# Altium project OSPLC2_2_STATUS.PrjPCB
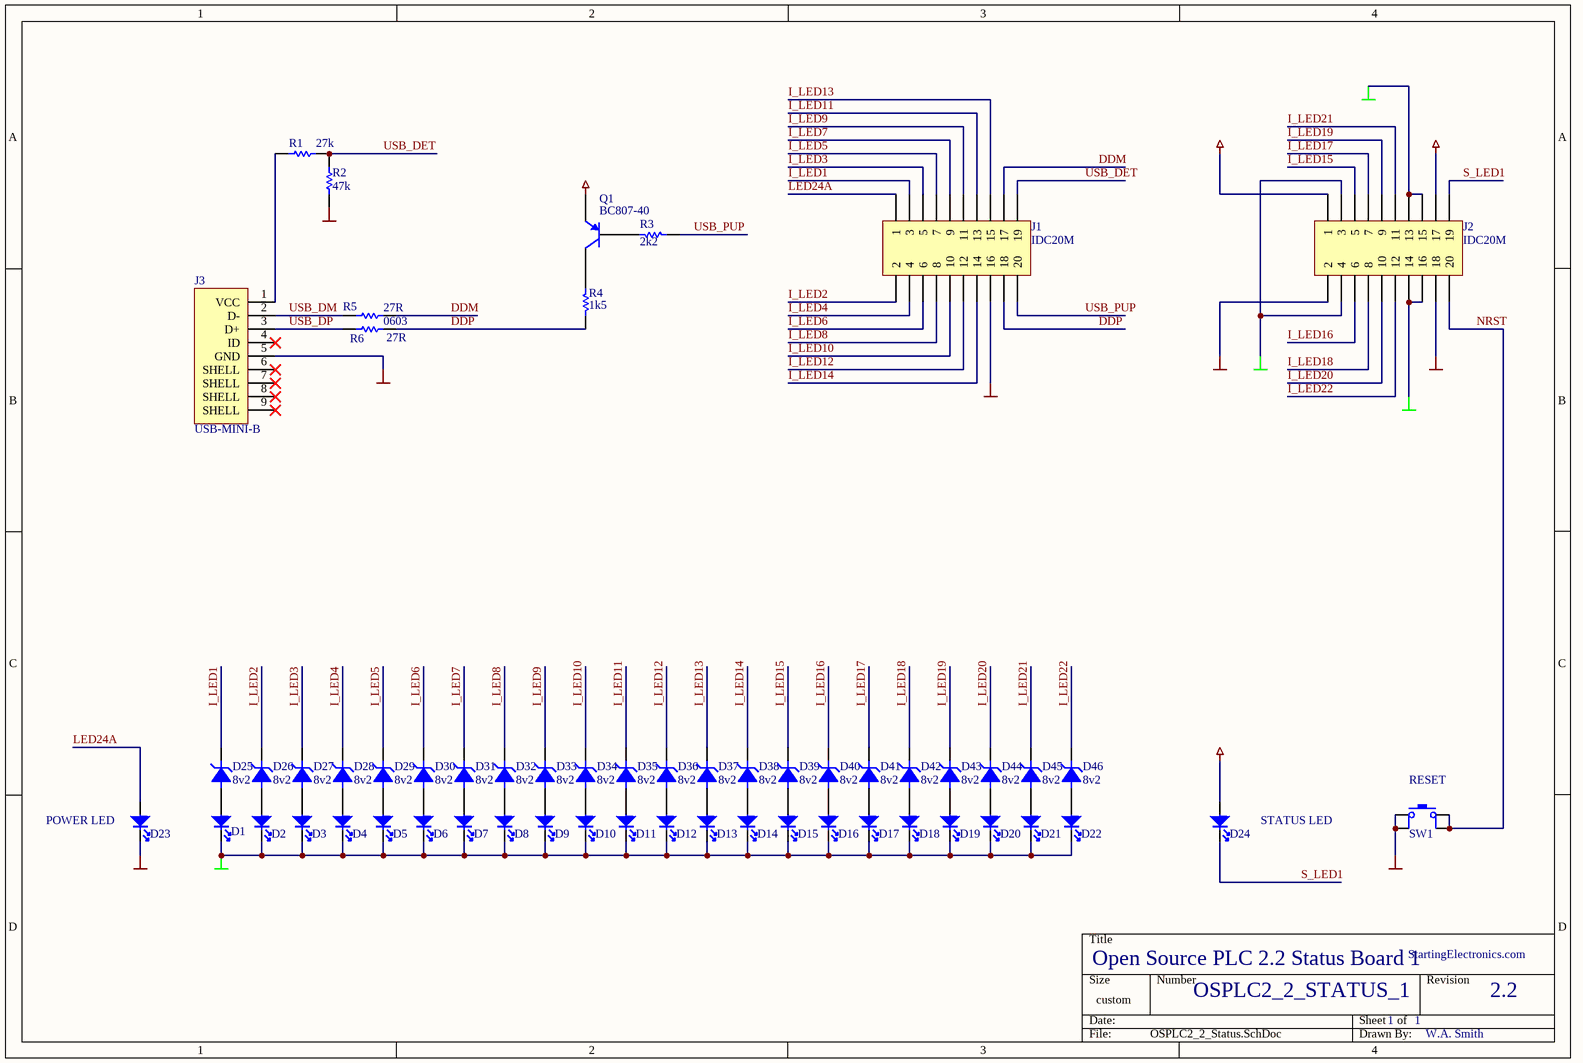
[diagram p0: OSPLC2_2_Status.SchDoc]
1 sheet, 57 parts. Net scope: global (net labels, ports and power ports of the same name join across sheets).
Board file: OSPLC2_2_STATUS.PcbDoc

## Sheet OSPLC2_2_Status.SchDoc
size 294 x 198 mm

### Parts
D1  LED  [1206_LED]  (value not drawn)
D2  LED  [1206_LED]  (value not drawn)
D3  LED  [1206_LED]  (value not drawn)
D4  LED  [1206_LED]  (value not drawn)
D5  LED  [1206_LED]  (value not drawn)
D6  LED  [1206_LED]  (value not drawn)
D7  LED  [1206_LED]  (value not drawn)
D8  LED  [1206_LED]  (value not drawn)
D9  LED  [1206_LED]  (value not drawn)
D10  LED  [1206_LED]  (value not drawn)
D11  LED  [1206_LED]  (value not drawn)
D12  LED  [1206_LED]  (value not drawn)
D13  LED  [1206_LED]  (value not drawn)
D14  LED  [1206_LED]  (value not drawn)
D15  LED  [1206_LED]  (value not drawn)
D16  LED  [1206_LED]  (value not drawn)
D17  LED  [1206_LED]  (value not drawn)
D18  LED  [1206_LED]  (value not drawn)
D19  LED  [1206_LED]  (value not drawn)
D20  LED  [1206_LED]  (value not drawn)
D21  LED  [1206_LED]  (value not drawn)
D22  LED  [1206_LED]  (value not drawn)
D23  LED  [1206_LED]  (value not drawn)
D24  LED  [1206_LED]  (value not drawn)
D25  8v2  [MELF-R2/X1.6]
D26  8v2  [MELF-R2/X1.6]
D27  8v2  [MELF-R2/X1.6]
D28  8v2  [MELF-R2/X1.6]
D29  8v2  [MELF-R2/X1.6]
D30  8v2  [MELF-R2/X1.6]
D31  8v2  [MELF-R2/X1.6]
D32  8v2  [MELF-R2/X1.6]
D33  8v2  [MELF-R2/X1.6]
D34  8v2  [MELF-R2/X1.6]
D35  8v2  [MELF-R2/X1.6]
D36  8v2  [MELF-R2/X1.6]
D37  8v2  [MELF-R2/X1.6]
D38  8v2  [MELF-R2/X1.6]
D39  8v2  [MELF-R2/X1.6]
D40  8v2  [MELF-R2/X1.6]
D41  8v2  [MELF-R2/X1.6]
D42  8v2  [MELF-R2/X1.6]
D43  8v2  [MELF-R2/X1.6]
D44  8v2  [MELF-R2/X1.6]
D45  8v2  [MELF-R2/X1.6]
D46  8v2  [MELF-R2/X1.6]
J1  IDC20M  [IDC_20M_BOX]
J2  IDC20M  [IDC_20M_BOX]
J3  USB-MINI-B  [USB_MINI]
Q1  BC807-40  [SO-G3/Y1]
R1  value 27k  [0805]  (hidden comment: 0805)
R2  value 47k  [0805]  (hidden comment: 0805)
R3  value 2k2  [0805]  (hidden comment: 0805)
R4  value 1k5  [0805]  (hidden comment: 0805)
R5  value 27R  [0603]  (hidden comment: 0603)
R6  0603  value 27R  [0603]
SW1  DTSMW-66  [DTSMW-66]  (value not drawn)

### Nets
GND: D23.2 J1.16 J2.2 J2.18 J3.5(GND) R2.1 SW1.1(SW1) SW1.2(SW2)
IN_GND: D1.2 D2.2 D3.2 D4.2 D5.2 D6.2 D7.2 D8.2 D9.2 D10.2 D11.2 D12.2 D13.2 D14.2 D15.2 D16.2 D17.2 D18.2 D19.2 D20.2 D21.2 D22.2 J2.3 J2.4 J2.13 J2.14 J2.15 J2.16
VCC3v3: D24.1 J2.1 J2.17 Q1.2(E)
DDM: J1.17 R5.2
DDP: J1.18 R4.1 R6.2
I_LED1: D25.2(C) J1.3
I_LED2: D26.2(C) J1.2
I_LED3: D27.2(C) J1.5
I_LED4: D28.2(C) J1.4
I_LED5: D29.2(C) J1.7
I_LED6: D30.2(C) J1.6
I_LED7: D31.2(C) J1.9
I_LED8: D32.2(C) J1.8
I_LED9: D33.2(C) J1.11
I_LED10: D34.2(C) J1.10
I_LED11: D35.2(C) J1.13
I_LED12: D36.2(C) J1.12
I_LED13: D37.2(C) J1.15
I_LED14: D38.2(C) J1.14
I_LED15: D39.2(C) J2.5
I_LED16: D40.2(C) J2.6
I_LED17: D41.2(C) J2.7
I_LED18: D42.2(C) J2.8
I_LED19: D43.2(C) J2.9
I_LED20: D44.2(C) J2.10
I_LED21: D45.2(C) J2.11
I_LED22: D46.2(C) J2.12
LED24A: D23.1 J1.1
NRST: J2.20 SW1.3 SW1.4
S_LED1: D24.2 J2.19
USB_DET: J1.19 R1.2 R2.2
USB_DM: J3.2(D-) R5.1
USB_DP: J3.3(D+) R6.1
USB_PUP: J1.20 R3.1
NetD1_1: D1.1 D25.1(A)
NetD2_1: D2.1 D26.1(A)
NetD3_1: D3.1 D27.1(A)
NetD4_1: D4.1 D28.1(A)
NetD5_1: D5.1 D29.1(A)
NetD6_1: D6.1 D30.1(A)
NetD7_1: D7.1 D31.1(A)
NetD8_1: D8.1 D32.1(A)
NetD9_1: D9.1 D33.1(A)
NetD10_1: D10.1 D34.1(A)
NetD11_1: D11.1 D35.1(A)
NetD12_1: D12.1 D36.1(A)
NetD13_1: D13.1 D37.1(A)
NetD14_1: D14.1 D38.1(A)
NetD15_1: D15.1 D39.1(A)
NetD16_1: D16.1 D40.1(A)
NetD17_1: D17.1 D41.1(A)
NetD18_1: D18.1 D42.1(A)
NetD19_1: D19.1 D43.1(A)
NetD20_1: D20.1 D44.1(A)
NetD21_1: D21.1 D45.1(A)
NetD22_1: D22.1 D46.1(A)
NetJ3_1: J3.1(VCC) R1.1
NetQ1_1: Q1.1(B) R3.2
NetQ1_3: Q1.3(C) R4.2

Not connected (* = marked no-connect by the designer): J3 4(ID)* 6(SHELL)* 7(SHELL)* 8(SHELL)* 9(SHELL)*

### Notes on the sheet
- (near SW1) RESET
- (near D23) POWER LED
- (near D24) STATUS LED
- Open Source PLC 2.2 Status Board 1
- OSPLC2_2_STATUS_1
- StartingElectronics.com
- 2.2
- 1
- W.A. Smith

### Library data of the parts
D1-D24 = LED_1206: 1206 footpring LED
D25-D46 = BZV55C: SMT Zenter Diode; Value: 8v2
J1 J2 = IDC_20M: 20 pin IDC male connector, vertical, box
J3 = USB-MINI-B: USB Miniature Type B Connector; Value: USB-MINI-B
Q1 = BC807-40: PNP General Purpose Amplifier; Manufacturer: Fairchild Semiconductor; Revision 1: 11-July-2000: SIM Model Added.; Revision 2: July-2002: Re-released for DXP Platform.; Package Information: Latest Revision: Sep-1998; Class I: Discrete; Class II: BJT - Low Power; Published: 8-Jun-2000; Datasheet: Latest Revision: 1997; Package Reference: SOT-23A; Publisher: Altium Limited
R1-R4 = RES_0805: 0805 footprint resistor
R5 R6 = RES_0603: 0603 footprint resistor
SW1 = PB_SWITCH_DTSMW-66: Diptronics SMT Tactile Push Button Switch; Value: PB_SWITCH_DTSMW-66